# EAGLE design ASBS_radio_v0 (EAGLE 5.11)
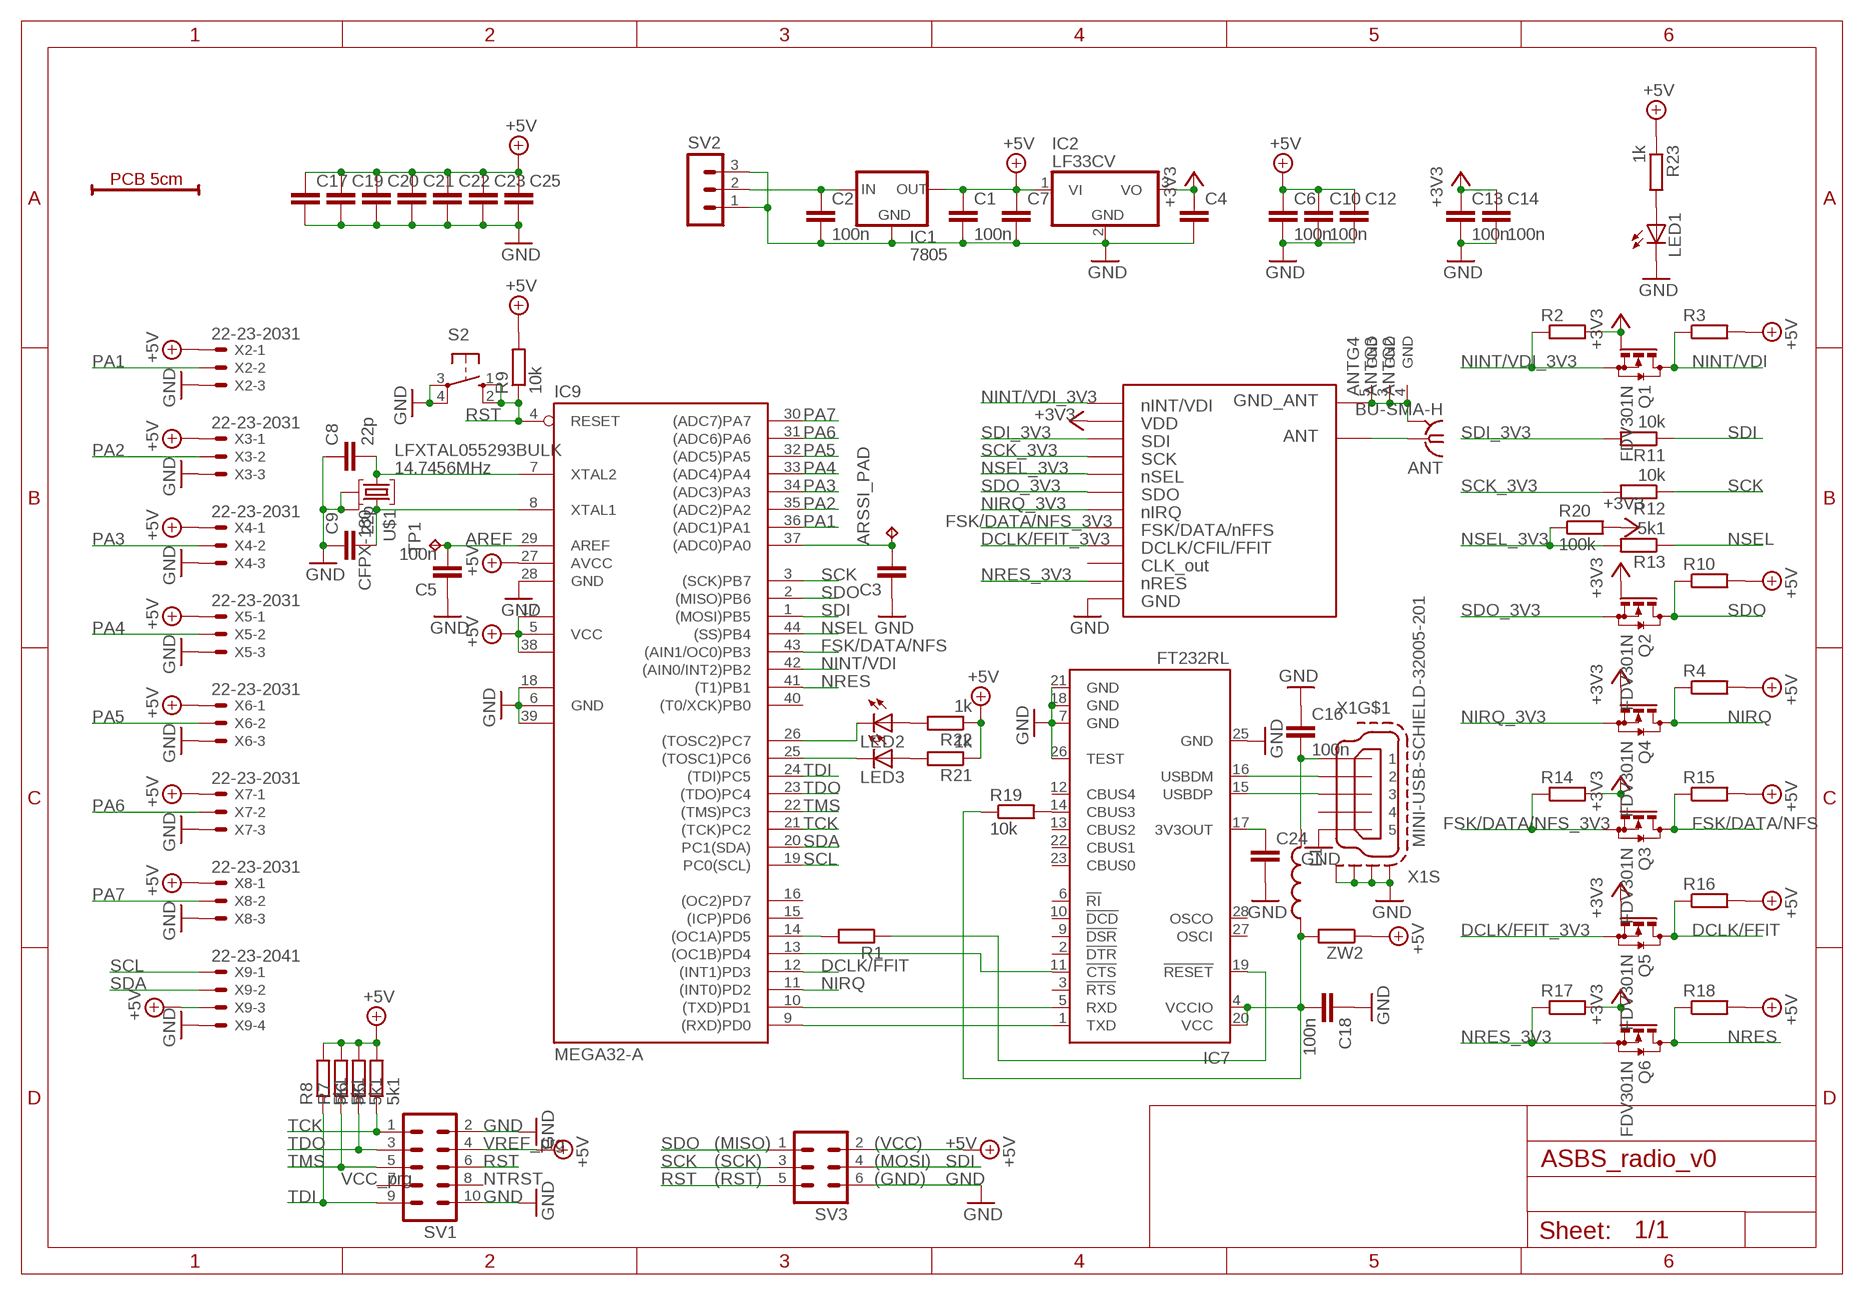
[diagram p0: schematic, sheet 1]

## Parts
ANT  BU-SMA-H  [BU-SMA-H]
ARSSI_PAD  TPTP20R  [TP20R]
C1  100n  C-EUC0805  [C0805]
C2  100n  C-EUC0805  [C0805]
C3  C-EUC0805  [C0805]
C4  C-EUC0805  [C0805]
C5  100n  C-EUC0805  [C0805]
C6  100n  C-EUC0805  [C0805]
C7  C-EUC0805  [C0805]
C8  22p  C-EUC0603K  [C0603K]
C9  22p  C-EUC0603K  [C0603K]
C10  100n  C-EUC0805  [C0805]
C12  C-EUC0805  [C0805]
C13  100n  C-EUC0805  [C0805]
C14  100n  C-EUC0805  [C0805]
C16  100n  C-EUC0805  [C0805]
C17  C-EUC0805  [C0805]
C18  100n  C-EUC0805  [C0805]
C19  C-EUC0805  [C0805]
C20  C-EUC0805  [C0805]
C21  C-EUC0805  [C0805]
C22  C-EUC0805  [C0805]
C23  C-EUC0805  [C0805]
C24  C-EUC0805  [C0805]
C25  C-EUC0805  [C0805]
IC1  7805  78XXS  [78XXS]
IC2  LF33CV  7805TV  [TO220V]
IC7  FT232RL  [SSOP28]
IC9  MEGA32-A  [TQFP44]
L1  L-US0207/5V  [0207/5V]
LED1  LEDCHIP-LED0805  [CHIP-LED0805]
LED2  LEDCHIP-LED0805  [CHIP-LED0805]
LED3  LEDCHIP-LED0805  [CHIP-LED0805]
Q1  FDV301N  BSS123  [SOT23]
Q2  FDV301N  BSS123  [SOT23]
Q3  FDV301N  BSS123  [SOT23]
Q4  FDV301N  BSS123  [SOT23]
Q5  FDV301N  BSS123  [SOT23]
Q6  FDV301N  BSS123  [SOT23]
R1  R-EU_R0603  [R0603]
R2  R-EU_R0603  [R0603]
R3  R-EU_R0603  [R0603]
R4  R-EU_R0603  [R0603]
R5  5k1  R-EU_R0603  [R0603]
R6  5k1  R-EU_R0603  [R0603]
R7  5k1  R-EU_R0603  [R0603]
R8  5k1  R-EU_R0603  [R0603]
R9  10k  R-EU_R0603  [R0603]
R10  R-EU_R0603  [R0603]
R11  10k  R-EU_R0603  [R0603]
R12  10k  R-EU_R0603  [R0603]
R13  5k1  R-EU_R0603  [R0603]
R14  R-EU_R0603  [R0603]
R15  R-EU_M1206  [M1206]
R16  R-EU_R0603  [R0603]
R17  R-EU_R0603  [R0603]
R18  R-EU_R0603  [R0603]
R19  10k  R-EU_R0603  [R0603]
R20  100k  R-EU_M1206  [M1206]
R21  1k  R-EU_R0603  [R0603]
R22  1k  R-EU_R0603  [R0603]
R23  1k  R-EU_R0603  [R0603]
S2  10-XX  [B3F-10XX]
SV1  MA05-2  [MA05-2]
SV2  MA03-1  [MA03-1]
SV3  MA03-2  [MA03-2]
TP1  TPPAD1-17  [P1-17]
U$1  CFPX-180  [CFPX-180]
U$2  RFM12B  [RFM12B_DIL]
U$3  SCALE_5CM  [SCALE_5CM]
X1  MINI-USB-SCHIELD-32005-201  [32005-201]
X2  22-23-2031  [22-23-2031]
X3  22-23-2031  [22-23-2031]
X4  22-23-2031  [22-23-2031]
X5  22-23-2031  [22-23-2031]
X6  22-23-2031  [22-23-2031]
X7  22-23-2031  [22-23-2031]
X8  22-23-2031  [22-23-2031]
X9  22-23-2041  [22-23-2041]
ZW2  R-EU_R0603  [R0603]

## Nets
+3V3: C4.1 C13.1 C14.1 IC2.3(VO) Q1.1(G) Q2.1(G) Q3.1(G) Q4.1(G) Q5.1(G) Q6.1(G) R2.2 R14.2 R17.2 R20.2 U$2.P$2
+5V: C1.1 C6.1 C7.1 C10.1 C12.1 C17.1 C19.1 C20.1 C21.1 C22.1 C23.1 C25.1 IC1.OUT IC2.1(VI) IC9.5(VCC) IC9.17(VCC1) IC9.27(AVCC) IC9.38(VCC2) R3.2 R4.2 R5.2 R6.2 R7.2 R8.2 R9.2 R10.2 R15.2 R16.2 R18.2 R21.1 R22.1 R23.1 SV1.4 SV3.2 X2.1 X3.1 X4.1 X5.1 X6.1 X7.1 X8.1 X9.3 ZW2.1
AREF: C5.2 IC9.29(AREF) TP1.TP
ARSSI: ARSSI_PAD.TP C3.2 IC9.37((ADC0)PA0)
DCLK/FFIT: IC9.12((INT1)PD3) Q5.3(D) R16.1
DCLK/FFIT_3V3: Q5.2(S) U$2.P$9
FSK/DATA/NFS: IC9.43((AIN1/OC0)PB3) Q3.3(D) R15.1
FSK/DATA/NFS_3V3: Q3.2(S) R14.1 U$2.P$8
GND: C1.2 C2.2 C3.1 C4.2 C5.1 C6.2 C7.2 C8.1 C9.1 C10.2 C12.2 C13.2 C14.2 C16.1 C17.2 C18.1 C19.2 C20.2 C21.2 C22.2 C23.2 C24.2 C25.2 IC1.GND IC2.2(GND) IC7.7(GND) IC7.18(GND) IC7.21(GND) IC7.25(GND) IC7.26(TEST) IC9.6(GND) IC9.18(GND1) IC9.28(GND) IC9.39(GND2) LED1.C S2.3(P) S2.4(P1) SV1.2 SV1.10 SV2.1 SV2.3 SV3.6 U$1.P$2 U$1.P$4 U$2.P$12 X1.5 X1.M1(S:S1) X1.M2(S:S2) X1.M3(S:S3) X1.M4(S:S4) X2.3 X3.3 X4.3 X5.3 X6.3 X7.3 X8.3 X9.4
N$1: IC7.11(!CTS) IC9.13((OC1B)PD4)
N$2: IC7.19(!RESET) R1.1
N$3: IC9.14((OC1A)PD5) R1.2
N$4: C2.1 IC1.IN SV2.2
N$5: C9.2 IC9.8(XTAL1) U$1.P$3
N$6: C8.2 IC9.7(XTAL2) U$1.P$1
N$7: IC7.14(CBUS3) R19.2
N$11: ANT.1 U$2.P$13
N$14: IC9.26((TOSC2)PC7) LED2.C
N$15: IC7.1(TXD) IC9.9((RXD)PD0)
N$16: IC7.5(RXD) IC9.10((TXD)PD1)
N$17: IC9.25((TOSC1)PC6) LED3.C
N$18: LED3.A R21.2
N$19: LED2.A R22.2
N$21: LED1.A R23.2
N$39: C18.2 IC7.4(VCCIO) IC7.20(VCC) L1.1 R19.1 ZW2.2
N$43: C16.2 L1.2 X1.1
N$44: IC7.16(USBDM) X1.2
N$45: IC7.15(USBDP) X1.3
N$46: C24.1 IC7.17(3V3OUT)
NINT/VDI: IC9.42((AIN0/INT2)PB2) Q1.3(D) R3.1
NINT/VDI_3V3: Q1.2(S) R2.1 U$2.P$1
NIRQ: IC9.11((INT0)PD2) Q4.3(D) R4.1
NIRQ_3V3: Q4.2(S) U$2.P$7
NRES: IC9.41((T1)PB1) Q6.3(D) R18.1
NRES_3V3: Q6.2(S) R17.1 U$2.P$11
NSEL: IC9.44((SS)PB4) R13.1
NSEL_3V3: R13.2 R20.1 U$2.P$5
PA1: IC9.36((ADC1)PA1) X2.2
PA2: IC9.35((ADC2)PA2) X3.2
PA3: IC9.34((ADC3)PA3) X4.2
PA4: IC9.33((ADC4)PA4) X5.2
PA5: IC9.32((ADC5)PA5) X6.2
PA6: IC9.31((ADC6)PA6) X7.2
PA7: IC9.30((ADC7)PA7) X8.2
RGND: ANT.2(GND) ANT.3(GND) ANT.4(GND) ANT.5(GND) U$2.P$14
RST: IC9.4(RESET) R9.1 S2.1(S) S2.2(S1) SV1.6 SV3.5
SCK: IC9.3((SCK)PB7) R12.1 SV3.3
SCK_3V3: R12.2 U$2.P$4
SCL: IC9.19(PC0(SCL)) X9.1
SDA: IC9.20(PC1(SDA)) X9.2
SDI: IC9.1((MOSI)PB5) R11.1 SV3.4
SDI_3V3: R11.2 U$2.P$3
SDO: IC9.2((MISO)PB6) Q2.3(D) R10.1 SV3.1
SDO_3V3: Q2.2(S) U$2.P$6
TCK: IC9.21((TCK)PC2) R5.1 SV1.1
TDI: IC9.24((TDI)PC5) R8.1 SV1.9
TDO: IC9.23((TDO)PC4) R6.1 SV1.3
TMS: IC9.22((TMS)PC3) R7.1 SV1.5
Unconnected: IC7.2(!DTR) IC7.3(!RTS) IC7.6(!RI) IC7.9(!DSR) IC7.10(!DCD) IC7.12(CBUS4) IC7.13(CBUS2) IC7.22(CBUS1) IC7.23(CBUS0) IC7.27(OSCI) IC7.28(OSCO) IC9.15((ICP)PD6) IC9.16((OC2)PD7) IC9.40((T0/XCK)PB0) SV1.7 SV1.8 U$2.P$10 X1.4

## Notes on the sheet
- LFXTAL055293BULK
- 14.7456MHz
- GND
- VREF_prg | (MISO) | (VCC)
- (SCK) | (MOSI)
- VCC_prg | NTRST | (RST) | (GND)
- GND

## Library data of the parts
ANT = con-coax:BU-SMA-H: FEMALE SMA CONNECTOR Radiall; OC_FARNELL: unknown; OC_NEWARK: unknown
ARSSI_PAD TP1 = testpad:TP: Test pad
C1-C7 C10 C12-C14 C16-C25 = rcl:C-EU: CAPACITOR, European symbol
C8 C9 = resistor:C-EU: CAPACITOR, European symbol
IC1 = v-reg:78XXS: VOLTAGE REGULATOR
IC2 = linear:78*: Positive VOLTAGE REGULATOR Source: http://cache.national.com/ds/LM/LM78L05.pdf http://www.fairchildsemi.com/ds/LM/LM7805.pdf
IC7 = ftdichip:FT232R: Source: http://www.ftdichip.com/Documents/DataSheets/DS_FT232R_v104.pdf; MPN: FT232RL; OC_FARNELL: 1146032; OC_NEWARK: 91K9918
IC9 = atmel:MEGA32: MICROCONTROLLER 32 Kbytes FLASH 2 Kbytes SRAM 1 Kbytes EEPROM USART 8-channel 10 bit ADC Source: www.atmel.com .. doc2503.pdf; MPN: ATMEGA32-16AU; OC_FARNELL: 9171274; OC_NEWARK: 69K6677
L1 = resistor:L-US: INDUCTOR, American symbol
LED1-LED3 = led:LED: LED OSRAM: - CHIPLED LG R971, LG N971, LY N971, LG Q971, LY Q971, LO R971, LY R971 LH N974, LH R974 LS Q976, LO Q976, LY Q976 LO Q996 - Hyper CHIPLED LW Q18S LB Q993, LB Q99A, LB R99A - SideLED LS A670, LO A670, LY A670, LG A670, LP A670 LB A673, LV A673, LT A673, LW A673 LH A674 LY A675 LS A676, LA A676, LO A676, LY A676, LW A676 LS A679, LY A679, LG A679 - Hyper Micro SIDELED® LS Y876, LA Y876, LO Y876, LY Y876 LT Y87S - SmartLED LW L88C, LW L88S LB L89C, LB L89S, LG L890 LS L89K, LO L89K, LY L89K LS L896, LA L896, LO L896, LY L896 - TOPLED LS T670, LO T670, LY T670, LG T670, LP T670 LSG T670, LSP T670, LSY T670, LOP T670, LYG T670 LG T671, LOG T671, LSG T671 LB T673, LV T673, LT T673, LW T673 LH T674 LS T676, LA T676, LO T676, LY T676, LB T676, LH T676, LSB T676, LW T676 LB T67C, LV T67C, LT T67C, LS T67K, LO T67K, LY T67K, LW E67C LS E67B, LA E67B, LO E67B, LY E67B, LB E67C, LV E67C, LT E67C LW T67C LS T679, LY T679, LG T679 LS T770, LO T770, LY T770, LG T770, LP T770 LB T773, LV T773, LT T773, LW T773 LH T774 LS E675, LA E675, LY E675, LS T675 LS T776, LA T776, LO T776, LY T776, LB T776 LHGB T686 LT T68C, LB T68C - Hyper Mini TOPLED® LB M676 - Mini TOPLED Santana® LG M470 LS M47K, LO M47K, LY M47K Source: http://www.osram.convergy.de LUXEON: - LUMILED® LXK2-PW12-R00, LXK2-PW12-S00, LXK2-PW14-U00, LXK2-PW14-V00 LXK2-PM12-R00, LXK2-PM12-S00, LXK2-PM14-U00 LXK2-PE12-Q00, LXK2-PE12-R00, LXK2-PE12-S00, LXK2-PE14-T00, LXK2-PE14-U00 LXK2-PB12-K00, LXK2-PB12-L00, LXK2-PB12-M00, LXK2-PB14-N00, LXK2-PB14-P00, LXK2-PB14-Q00 LXK2-PR12-L00, LXK2-PR12-M00, LXK2-PR14-Q00, LXK2-PR14-R00 LXK2-PD12-Q00, LXK2-PD12-R00, LXK2-PD12-S00 LXK2-PH12-R00, LXK2-PH12-S00 LXK2-PL12-P00, LXK2-PL12-Q00, LXK2-PL12-R00 Source: www.luxeon.com KINGBRIGHT: KA-3528ASYC Source: www.kingbright.com
Q1-Q6 = transistor-small-signal:BSS123: N-CHANNEL MOS FET
R1-R14 R16-R19 R21-R23 ZW2 = resistor:R-EU_: RESISTOR, European symbol
R15 R20 = rcl:R-EU_: RESISTOR, European symbol
S2 = switch-omron:10-XX: OMRON SWITCH; MPN: B3F-1000; OC_FARNELL: 176432; OC_NEWARK: 36M3542
SV1 = con-lstb:MA05-2: PIN HEADER; OC_FARNELL: unknown; OC_NEWARK: unknown
SV2 = con-lstb:MA03-1: PIN HEADER; OC_FARNELL: unknown; OC_NEWARK: unknown
SV3 = con-lstb:MA03-2: PIN HEADER; OC_FARNELL: unknown; OC_NEWARK: unknown
U$1 = crystal_frequency_products:CFPX-180
U$2 = RFM12B:RFM12B
U$3 = scale:SCALE_5CM
X1 = con-cypressindustries:MINI-USB-SCHIELD-: MINI USB-B Conector Source: www.cypressindustries.com; OC_FARNELL: unknown; OC_NEWARK: unknown
X2-X8 = con-molex:22-23-2031: .100" (2.54mm) Center Header - 3 Pin; MF: MOLEX; MPN: 22-23-2031; OC_FARNELL: 1462950; OC_NEWARK: 30C0862
X9 = con-molex:22-23-2041: .100" (2.54mm) Center Header - 4 Pin; MF: MOLEX; MPN: 22-23-2041; OC_FARNELL: 1462920; OC_NEWARK: 38C0355

## Board
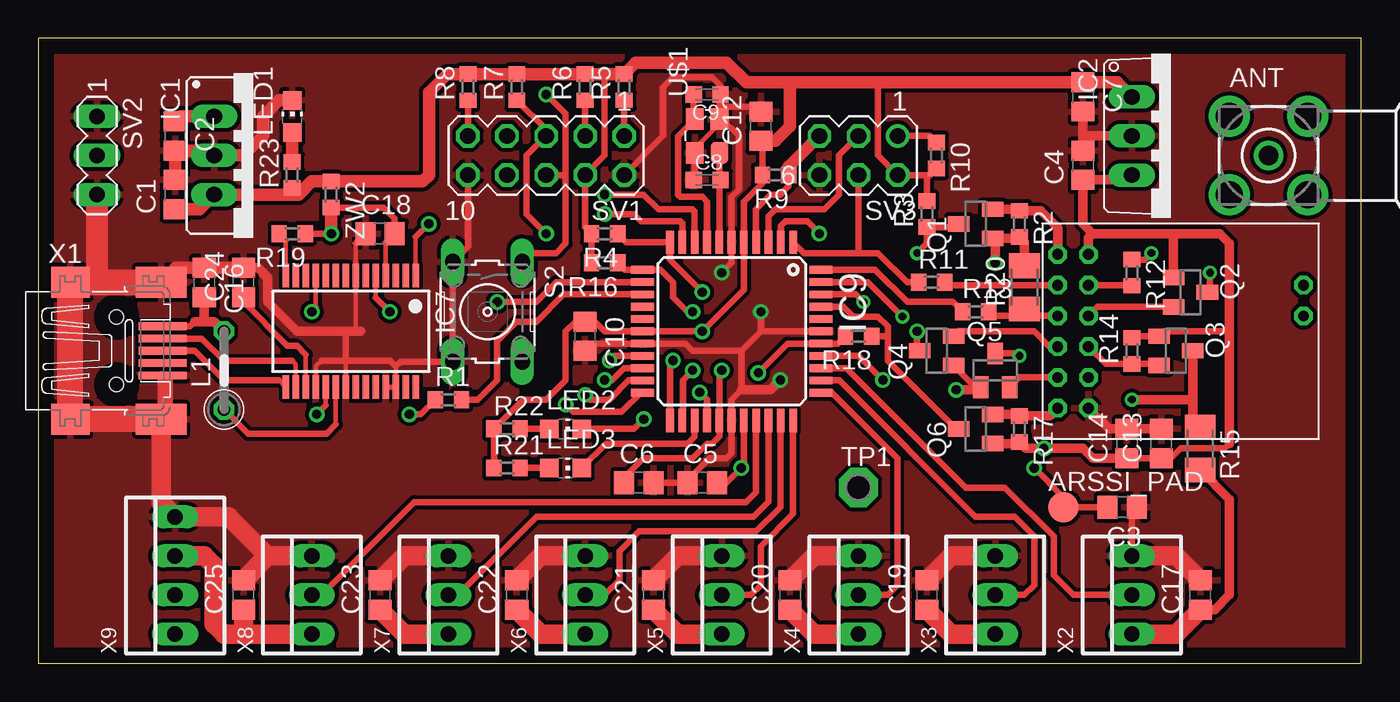
[diagram p1: board, top side]
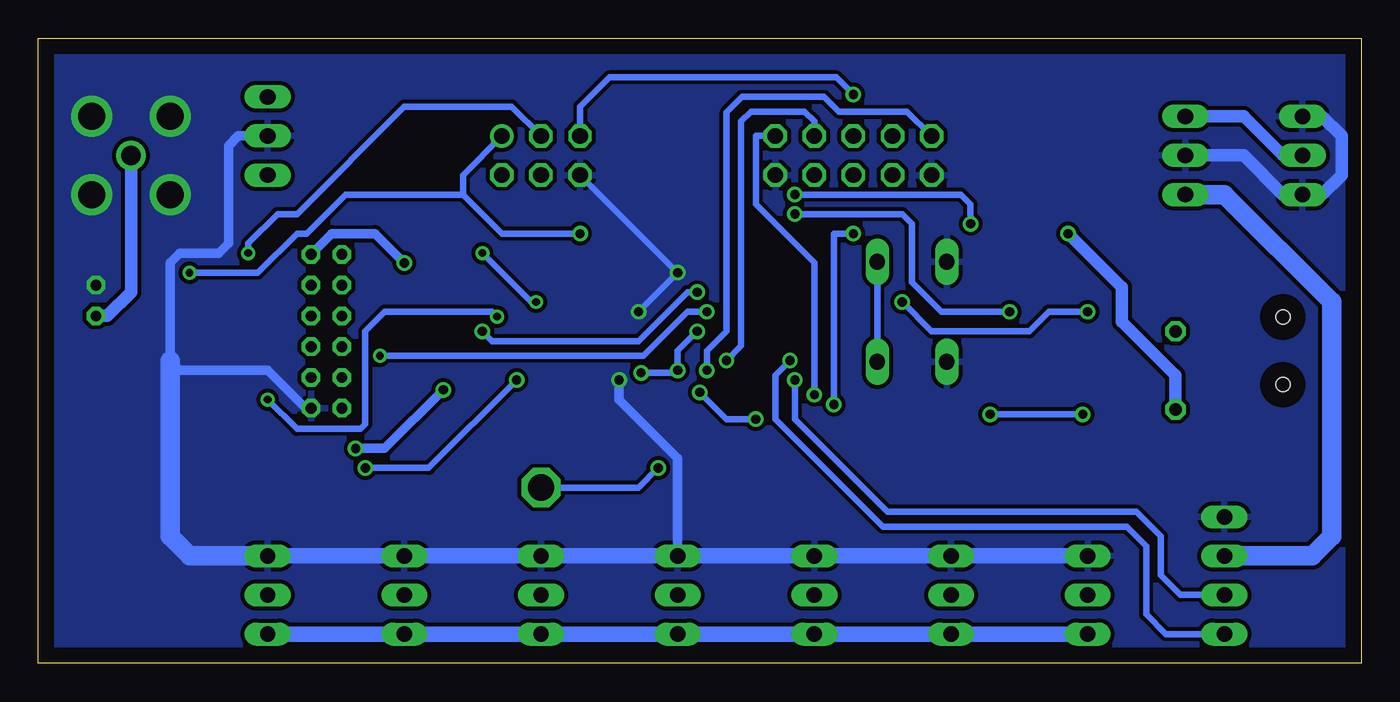
[diagram p2: board, bottom side, seen from below]

Size 86.03 x 40.63 mm. Coordinates in mm from the lower left corner, seen from the top.
Outline: 0,0 86.03,0 86.03,40.63 0,40.63 0,0
Copper layers (1*16): Top 0.035mm / dielectric 1.5mm / Bottom 0.035mm
Design rules "default *": minimum track width 10mil, minimum drill 0.4mm, track to track 10mil, track to pad 10mil, pad to pad 10mil, via to via 10mil, smd to smd 8mil, copper to edge 40mil, drill to drill 8mil, minimum pad ring 10mil, minimum via ring 8mil, stop-mask expansion 4mil, vias tented up to drill 0mil, thermal gap 10mil

### Footprints (pad centres in the part's own frame; a part is rotated, then mirrored left to right if it is on the bottom)
BU-SMA-H = drill 1.27 round: 1 0,0 | drill 1.778 round: 2 -2.55,2.55; 3 2.55,2.55; 4 2.55,-2.55; 5 -2.55,-2.55
TP20R = smd 2 x 2: TP 0,0
C0805 = smd 1.3 x 1.5: 1 -0.95,0; 2 0.95,0
C0603K = smd 1.05 x 1.08: 1 -0.875,0; 2 0.875,0
78XXS = drill 1.016 long: GND 0,-2.54; IN -2.54,-2.54; OUT 2.54,-2.54
TO220V = drill 1.016 long: 1 -2.54,-2.54; 2 0,-2.54; 3 2.54,-2.54
SSOP28 = smd 0.4 x 1.5: 1 -4.225,-3.625; 2 -3.575,-3.625; 3 -2.925,-3.625; 4 -2.275,-3.625; 5 -1.625,-3.625; 6 -0.975,-3.625; 7 -0.325,-3.625; 8 0.325,-3.625; 9 0.975,-3.625; 10 1.625,-3.625; 11 2.275,-3.625; 12 2.925,-3.625; 13 3.575,-3.625; 14 4.225,-3.625; 15 4.225,3.625; 16 3.575,3.625; 17 2.925,3.625; 18 2.275,3.625; 19 1.625,3.625; 20 0.975,3.625; 21 0.325,3.625; 22 -0.325,3.625; 23 -0.975,3.625; 24 -1.625,3.625; 25 -2.275,3.625; 26 -2.925,3.625; 27 -3.575,3.625; 28 -4.225,3.625
TQFP44 = smd 1.5 x 0.5: 1 -5.8,4; 2 -5.8,3.2; 3 -5.8,2.4; 4 -5.8,1.6; 5 -5.8,0.8; 6 -5.8,0; 7 -5.8,-0.8; 8 -5.8,-1.6; 9 -5.8,-2.4; 10 -5.8,-3.2; 11 -5.8,-4; 23 5.8,-4; 24 5.8,-3.2; 25 5.8,-2.4; 26 5.8,-1.6; 27 5.8,-0.8; 28 5.8,0; 29 5.8,0.8; 30 5.8,1.6; 31 5.8,2.4; 32 5.8,3.2; 33 5.8,4 | smd 0.5 x 1.5: 12 -4,-5.8; 13 -3.2,-5.8; 14 -2.4,-5.8; 15 -1.6,-5.8; 16 -0.8,-5.8; 17 0,-5.8; 18 0.8,-5.8; 19 1.6,-5.8; 20 2.4,-5.8; 21 3.2,-5.8; 22 4,-5.8; 34 4,5.8; 35 3.2,5.8; 36 2.4,5.8; 37 1.6,5.8; 38 0.8,5.8; 39 0,5.8; 40 -0.8,5.8; 41 -1.6,5.8; 42 -2.4,5.8; 43 -3.2,5.8; 44 -4,5.8
0207/5V = drill 0.813 octagon: 1 -2.54,0; 2 2.54,0
CHIP-LED0805 = smd 1.2 x 1.2: A 0,-1.05; C 0,1.05
SOT23 = smd 1 x 1.4: 1 -0.95,-1.1; 2 0.95,-1.1; 3 0,1.1
R0603 = smd 1 x 1.1: 1 -0.85,0; 2 0.85,0
M1206 = smd 1.6 x 2: 1 -1.4,0; 2 1.4,0
B3F-10XX = drill 1.016 long: 1 -3.251,2.261; 2 3.251,2.261; 3 -3.251,-2.261; 4 3.251,-2.261
MA05-2 = drill 1.016 octagon: 1 -5.08,-1.27; 2 -5.08,1.27; 3 -2.54,-1.27; 4 -2.54,1.27; 5 0,-1.27; 6 0,1.27; 7 2.54,-1.27; 8 2.54,1.27; 9 5.08,-1.27; 10 5.08,1.27
MA03-1 = drill 1.016 long: 1 -2.54,0; 2 0,0; 3 2.54,0
MA03-2 = drill 1.016 round: 1 -2.54,-1.27 | drill 1.016 octagon: 2 -2.54,1.27; 3 0,-1.27; 4 0,1.27; 5 2.54,-1.27; 6 2.54,1.27
P1-17 = drill 1.702 pad 2.54 octagon: TP 0,0
CFPX-180 = smd 1.4 x 1.15: P$1 -1.1,-0.8; P$2 1.1,-0.8; P$3 1.1,0.8; P$4 -1.1,0.8
RFM12B_DIL = drill 0.7 octagon: P$1 -8,5; P$2 -6,5; P$3 -8,3; P$4 -6,3; P$5 -8,1; P$6 -6,1; P$7 -8,-1; P$8 -6,-1; P$9 -8,-3; P$10 -6,-3; P$11 -8,-5; P$12 -6,-5; P$13 8,1; P$14 8,3
32005-201 = smd 3.1 x 0.5: 1 3,1.6; 2 3,0.8; 3 3,0; 4 3,-0.8; 5 3,-1.6 | smd 2.5 x 2: M1 -3,-4.45; M2 -3,4.45 | smd 3.3 x 2: M3 2.9,4.45; M4 2.9,-4.45 | hole 0.9: 0,2.2; 0,-2.2
22-23-2031 = drill 1 long: 1 -2.54,0; 2 0,0; 3 2.54,0
22-23-2041 = drill 1 long: 1 -3.81,0; 2 -1.27,0; 3 1.27,0; 4 3.81,0

### Placement (x,y rotation side)
ANT  80.01,33.02 0 top
ARSSI_PAD  66.67,10.16 0 top
C1  8.89,30.48 90 top
C2  8.89,34.29 270 top
C3  70.48,10.16 180 top
C4  67.94,32.38 90 top
C5  43.18,11.75 0 top
C6  39.05,11.75 0 top
C7  67.94,36.83 270 top
C8  43.5,31.43 0 top
C9  43.5,36.99 180 top
C10  35.56,21.27 270 top
C12  46.99,34.92 90 top
C13  73.03,14.29 90 top
C14  70.8,14.29 90 top
C16  10.79,24.77 270 top
C17  75.56,4.45 90 top
C18  22.23,27.94 0 top
C19  57.78,4.45 90 top
C20  48.9,4.45 90 top
C21  40.01,4.45 90 top
C22  31.11,4.45 90 top
C23  22.23,4.45 90 top
C24  13.34,24.77 90 top
C25  13.34,4.45 90 top
IC1  13.97,33.02 270 top
IC2  73.66,34.29 270 top
IC7  20.32,21.59 180 top
IC9  45.09,21.59 270 top
L1  12.06,19.05 90 top
LED1  16.51,35.56 0 top
LED2  34.29,15.24 270 top
LED3  34.29,12.7 270 top
Q1  60.96,28.57 90 top
Q2  74.93,24.13 270 top
Q3  73.98,20.32 270 top
Q4  58.42,20.32 90 top
Q5  62.23,19.05 0 top
Q6  60.96,15.24 90 top
R1  26.67,17.14 0 top
R2  63.82,28.57 270 top
R3  57.78,29.21 90 top
R4  36.83,27.94 180 top
R5  38.1,37.47 90 top
R6  35.56,37.47 90 top
R7  31.11,37.47 90 top
R8  27.94,37.47 90 top
R9  47.94,31.75 180 top
R10  58.42,33.02 270 top
R11  58.1,24.77 0 top
R12  71.12,25.4 270 top
R13  60.96,22.86 0 top
R14  71.12,20.32 90 top
R15  75.56,13.97 270 top
R16  36.83,26.04 180 top
R17  63.82,15.24 270 top
R18  53.34,21.27 180 top
R19  16.51,27.94 180 top
R20  64.14,24.45 90 top
R21  30.48,12.7 0 top
R22  30.48,15.24 0 top
R23  16.51,31.75 90 top
S2  29.21,22.86 270 top
SV1  33.02,33.02 180 top
SV2  3.81,33.02 270 top
SV3  53.34,33.02 180 top
TP1  53.34,11.43 0 top
U$1  43.5,34.29 90 top
U$2  74.3,21.59 0 top
U$3  25.4,45.72 180 top  (outside the outline)
X1  5.08,20.32 0 top
X2  71.12,4.45 90 top
X3  62.23,4.45 90 top
X4  53.34,4.45 90 top
X5  44.45,4.45 90 top
X6  35.56,4.45 90 top
X7  26.67,4.45 90 top
X8  17.78,4.45 90 top
X9  8.89,5.71 90 top
ZW2  19.05,30.48 270 top

### Tracks (layer width: path | path; a pad name or v marks a point on that pad's centre or on a via)
+3V3  (via drill 0.6)
  Top 0.406: R14.2 71.22,21.27 Q3.1 73.2,21.59 77.47,21.59 | Q5.1 60.94,17.95 Q4.1 | 77.47,14.29 77.15,13.97 74.3,13.97 73.66,13.34 C13.1 C14.1
  Top 0.61: C14.1 68.58,13.34 67.94,13.97 v65.41,13.97 64.24,13.97 R17.2 63.72,14.29 Q6.1 | Q5.1 61.11,17.78 v59.69,17.78 | 77.47,14.29 77.47,21.59 77.47,27.3 76.83,27.94 73.83,27.94 | U$2.P$2 68.3,27.66 68.58,27.94 | 73.83,27.94 Q2.1 | 73.83,27.94 68.58,27.94 | 68.58,27.94 67.94,28.57 C4.1 70.81,31.43 IC2.3 | R20.2 64.14,27.41 R2.2 63.72,27.62 Q1.1 62.23,27.45 v62.23,26.04
  Bottom 0.61: v59.69,17.78 63.5,13.97 v65.41,13.97 | U$2.P$2 66.94,27.94 64.14,27.94 v62.23,26.04
+5V  (via drill 0.6)
  Top 0.406: R18.2 52.01,20.79 IC9.38 48.73,20.79 v46.83,18.89 | v44.45,19.05 44.28,18.89 IC9.27 44.28,14.76 43.81,14.29 43.5,14.29 42.55,13.34 39.37,13.34 38.1,12.07 C6.1 | R16.2 R4.2 35.56,28.36 SV1.4 36.83,33.02 36.83,38.1 37.05,38.31 R5.2 | R21.1 R22.1 31.54,17.14 33.02,17.14 34.29,18.41 34.29,21.59 34.92,22.22 C10.1 36.2,22.22 36.83,21.59 IC9.17 v43.18,21.59 45.88,24.3 IC9.5 45.88,30.01 47.09,31.22 R9.2 47.09,33.87 C12.1 | 54.61,37.78 54.61,33.02 SV3.2 57.78,31.75 | 57.78,31.75 R3.2 | R10.2 58,31.75 57.78,31.75 | 16.93,30.48 R23.1
  Top 0.61: X2.1 74.3,1.91 | R15.2 77.47,10.66 77.47,4.45 76.52,3.5 C17.1
  Top 0.813: 48.9,37.78 46.04,37.78 44.77,39.05 38.84,39.05 R5.2 R6.2 R7.2 R8.2 26.57,38.31 25.4,37.15 25.4,31.75 24.98,31.33 ZW2.1 17.78,31.33 16.93,30.48 IC1.OUT 10.48,29.53 C1.1 | 48.9,37.78 54.61,37.78 C7.1 70.17,37.78 IC2.1 | 48.9,37.78 48.9,34.92 47.95,33.98 C12.1
  Top 1.27: 13.34,1.91 12.06,1.91 11.43,2.54 11.43,6.35 10.79,6.99 X9.3 | 13.34,1.91 X8.1 | C17.1 73.97,1.91 X2.1 | C19.1 59.38,1.91 X3.1 | C20.1 50.48,1.91 X4.1 | C21.1 41.59,1.91 X5.1 | C22.1 32.7,1.91 X6.1 | C23.1 23.82,1.91 X7.1 | 13.34,1.91 C25.1
  Bottom 0.406: v43.18,21.59 44.45,20.32 v44.45,19.05 44.61,18.89 v46.83,18.89
  Bottom 1.016: X2.1 X3.1 X4.1 X5.1 X6.1 X7.1 X8.1
  Bottom 1.27: IC1.OUT 8.89,30.48 1.91,23.5 1.91,8.26 3.17,6.99 X9.3 9.53,6.99
AREF  (via drill 0.6)
  Top 0.406: IC9.29 45.88,12.87 v45.72,12.7 44.77,11.75 C5.2
  Bottom 0.406: TP1.TP 46.99,11.43 v45.72,12.7
ARSSI  (via drill 0.6)
  Top 0.406: IC9.37 53.35,19.99 v54.93,18.41 | v64.77,12.7 66.67,10.79 ARSSI_PAD.TP C3.2
  Bottom 0.406: v54.93,18.41 60.64,12.7 v64.77,12.7
DCLK/FFIT  (via drill 0.5, 0.6)
  Top 0.406: Q5.3 63.67,20.15 v63.82,20 | v42.55,22.86 42.23,22.86 41.27,23.81 41.27,24.77 40.45,25.59 IC9.12 38.12,25.59 R16.1
  Bottom 0.406: v63.82,20 46.67,20 43.81,22.86 v42.55,22.86
DCLK/FFIT_3V3
  Top 0.406: Q5.2 63.82,18.59 U$2.P$9
FSK/DATA/NFS  (via drill 0.5)
  Top 0.406: IC9.43 53.95,24.79 v56.2,22.54
  Top 0.61: v71.12,17.14 75.08,17.14 | 75.08,17.14 Q3.3 | R15.1 75.08,15.37 75.08,17.14
  Bottom 0.406: v56.2,22.54 56.52,22.86 63.5,22.86 64.77,21.59 64.77,15.56 65.09,15.24 69.22,15.24 v71.12,17.14
FSK/DATA/NFS_3V3
  Top 0.406: U$2.P$8 69.42,19.47 R14.1 72.78,19.47 Q3.2
GND  (via drill 0.6)
  Top 0.305: IC7.18 18.05,19.32 18.41,19.68 | 23.25,19.3 IC7.26 IC7.25 | 20,19.68 IC7.21 | 20.64,21.59 IC7.7 20.64,27.31 | 44.3,35.09 42.7,33.49
  Top 0.406: 8.26,18.41 8.08,18.59 X1.5 | 20,19.68 18.41,19.68 | 20,19.68 22.86,19.68 23.25,19.3 23.55,19.61 S2.4 S2.3 27.94,27.1 SV1.10 | 20.95,21.59 20.64,21.59 20.32,21.59 20,21.59 20,19.68 | v44.45,25.4 45.09,26.04 IC9.6 45.09,30.32 45.56,30.8 45.56,34.29 44.46,35.39 U$1.P$2 | U$1.P$2 44.62,35.39 | U$1.P$2 44.3,36.2 | 44.3,36.2 44.3,36.91 C9.1 44.37,37.54 43.81,38.1 41.27,38.1 40.64,37.47 40.64,34.29 SV1.2 | 42.7,33.49 U$1.P$4 42.7,31.51 C8.1 | U$1.P$2 44.3,35.09 | C12.2 46.67,36.2 44.3,36.2 | 20.64,27.31 C18.1 | C6.2 C5.1 42.23,11.91 43.66,13.34 44.77,13.34 45.09,13.65 IC9.28 45.09,17.14 45.72,17.78 45.72,20.32 | C3.1 71.12,9.85 X2.3 | 45.72,20.32 42.55,20.32 42.08,20.79 IC9.18 36.03,20.79 C10.2 | 45.72,20.32 46.99,21.59 | 46.99,21.59 IC9.39 | 46.99,21.59 v46.99,22.86
  Top 0.61: C24.2 14.29,25.71 14.92,25.08 14.92,23.5 16.83,21.59 20.32,21.59 20.95,21.59 | C13.2 C14.2 69.65,15.24 U$2.P$12 | IC2.2 67.94,34.29 | 67.94,34.29 C7.2 | 67.94,34.29 C4.2 | 45.72,17.78 47.62,17.78 v48.26,18.41
  Top 0.813: X1.M3 8.93,25.71 C16.1 C24.2 | C1.2 C2.2 11.11,33.34 IC1.GND 13.34,33.02 14.61,34.29 14.61,35.56 15.65,36.61 LED1.C
  Top 1.016: X1.M4 8.26,16.14 8.26,18.41
  Top 1.27: X1.M4 7.98,10.44 X9.4 12.38,9.53 14.93,6.99 | C17.2 73.97,6.99 X2.3 | C19.2 59.38,6.99 X3.3 | C20.2 50.48,6.99 X4.3 | C21.2 41.59,6.99 X5.3 | C22.2 32.7,6.99 X6.3 | C23.2 23.82,6.99 X7.3 | 14.93,6.99 C25.2 | 14.93,6.99 X8.3
  Top 1.422: SV2.3 3.81,24.77 X1.M2
  Top 1.676: X1.M3 X1.M2 X1.M1 X1.M4
  Bottom 0.406: v46.99,22.86 v44.45,25.4 SV3.6
  Bottom 0.61: U$2.P$12 68.66,16.59 71.12,19.05 76.83,19.05 77.47,19.68 77.47,26.04 76.83,26.67 74.3,26.67 73.66,27.3 73.66,33.66 73.03,34.29 IC2.2 | v48.26,18.41 48.26,17.14 44.45,13.34 X5.3
  Bottom 0.813: SV2.1 2.54,35.56 1.27,34.29 1.27,31.75 2.54,30.48 SV2.3 5.08,30.48 7.62,33.02 IC1.GND
  Bottom 1.016: X8.3 X7.3 X6.3 X5.3 X4.3 X3.3 X2.3
  Bottom 1.27: X2.3 76.2,6.99 77.47,8.26 77.47,19.68
  pour Top: 0,40.64 0,0 86.36,0 86.36,40.64
  pour Bottom: 0,40.64 0,0 86.36,0 86.36,40.64
N$1  (via drill 0.6)
  Top 0.305: IC7.11 18.05,23.12
  Top 0.406: 18.05,23.12 v17.78,22.86 | IC9.13 33.68,24.79 32.38,23.5 v29.84,23.5
  Bottom 0.406: v17.78,22.86 20.32,22.86 21.59,21.59 27.94,21.59 v29.84,23.5
N$2  (via drill 0.6)
  Top 0.305: 18.7,16.79 IC7.19
  Top 0.406: v18.1,16.19 18.7,16.79 | v24.13,16.19 24.87,16.19 R1.1
  Bottom 0.406: v18.1,16.19 v24.13,16.19
N$3
  Top 0.406: IC9.14 34.15,23.99 32.38,22.23 31.11,22.23 29.84,20.95 29.84,18.41 28.57,17.14 R1.2
N$4
  Top 0.813: C2.1 9.21,35.56 IC1.IN
  Bottom 0.813: SV2.2 5.08,33.02 7.62,35.56 IC1.IN
N$5
  Top 0.406: IC9.8 43.5,27.4 43.5,30 43.18,30.32 41.75,30.32 41.59,30.48 41.59,34.28 U$1.P$3 42.62,35.47 C9.2
N$6
  Top 0.406: U$1.P$1 44.3,31.51 C8.2 44.28,31.34 IC9.7
N$7
  Top 0.305: IC7.14 16.09,27.5
  Top 0.406: 16.09,27.5 R19.2
N$11
  Bottom 0.813: U$2.P$13 81.55,22.59 80.01,24.13 ANT.1
N$14  (via drill 0.6)
  Top 0.406: v43.02,17.62 43.48,17.16 IC9.26 | LED2.C 38.73,15.24 v39.37,15.88
  Bottom 0.406: v39.37,15.88 41.27,15.88 v43.02,17.62
N$15  (via drill 0.6)
  Top 0.305: IC7.1 24.55,27.72
  Top 0.406: v36.83,30.48 39.37,30.48 40.32,29.53 42.55,29.53 42.69,29.39 IC9.9 | 24.55,27.72 v25.4,28.57
  Bottom 0.406: v36.83,30.48 26.04,30.48 25.4,29.84 v25.4,28.57
N$16  (via drill 0.6)
  Top 0.305: IC7.5 21.95,23.77
  Top 0.406: 21.95,23.77 v22.86,22.86 | IC9.10 41.88,28.6 41.75,28.73 39.21,28.73 38.73,29.21 v36.83,29.21
  Bottom 0.406: v22.86,22.86 27.3,22.86 29.21,24.77 29.21,28.57 29.84,29.21 v36.83,29.21
N$17
  Top 0.406: IC9.25 42.69,14.74 42.23,14.29 36.93,14.29 LED3.C
N$18
  Top 0.406: R21.2 LED3.A
N$19
  Top 0.406: R22.2 LED2.A
N$21
  Top 0.813: R23.2 LED1.A
N$39  (via drill 0.6)
  Top 0.305: 19.34,15.54 IC7.20 | 22.59,27.36 IC7.4
  Top 0.406: v19.05,27.94 R19.1 | ZW2.2 22.44,29.63 23.18,28.89 C18.2 22.59,27.36 | L1.1 13.65,14.92 18.73,14.92 19.34,15.54
  Top 0.813: v19.05,27.94 ZW2.2
  Bottom 0.813: L1.1 12.06,18.73 15.56,22.23 15.56,24.45 v19.05,27.94
N$43
  Top 0.406: X1.1 9.86,21.92 10.16,22.23
  Top 0.61: 10.16,22.23 10.79,22.23 | L1.2 11.43,22.23 10.79,22.23 | 10.79,22.23 C16.2
N$44
  Top 0.305: 16.51,19.68 16.75,19.45 IC7.16
  Top 0.406: X1.2 10.63,21.12 12.06,19.68 16.51,19.68
N$45
  Top 0.305: 15.64,18.41 IC7.15
  Top 0.406: 15.64,18.41 12.06,18.41 10.16,20.32 X1.3
N$46
  Top 0.305: IC7.17 17.39,20.07
  Top 0.406: 17.39,20.07 16.83,20.64 16.19,20.64 13.34,23.5 C24.1
NINT/VDI  (via drill 0.5)
  Top 0.406: IC9.42 53.16,23.99 v53.66,23.5 | v57.15,26.67 57.78,27.3 R3.1 59.65,28.36 Q1.3
  Bottom 0.406: v53.66,23.5 53.98,23.5 v57.15,26.67
NINT/VDI_3V3
  Top 0.61: U$2.P$1 66.3,28.32 65.19,29.43 R2.1 63.72,29.52 Q1.2
NIRQ  (via drill 0.6)
  Top 0.406: v43.18,24.13 41.09,26.23 IC9.11 38.23,27.39 R4.1 | v57.15,21.59 57.15,20.49 Q4.3
  Bottom 0.406: v43.18,24.13 43.81,24.13 46.99,20.95 56.52,20.95 v57.15,21.59
NIRQ_3V3
  Top 0.406: U$2.P$7 65.77,20.59 64.77,21.59 59.84,21.59 Q4.2
NRES
  Top 0.406: IC9.41 52.38,23.19 53.02,22.54 54.61,22.54 55.24,21.91 55.24,21.27 | 55.24,21.27 R18.1 | Q6.3 59.69,15.24 55.24,19.68 55.24,21.27
NRES_3V3
  Top 0.61: Q6.2 63.72,16.19 R17.1 65.8,16.09 U$2.P$11
NSEL
  Top 0.406: IC9.44 54.42,25.59 56.52,23.5 59.48,23.5 R13.1
NSEL_3V3
  Top 0.406: 64.59,22.59 62.08,22.59 R13.2 | 64.59,22.59 R20.1 | 64.59,22.59 U$2.P$5
PA1
  Top 0.406: X2.2 67.31,4.45 66.04,5.71 66.04,8.26 62.87,11.43 60.33,11.43 52.56,19.19 IC9.36
PA2
  Top 0.406: X3.2 64.14,4.45 64.77,5.08 64.77,8.26 63.5,9.53 60.96,9.53 52.09,18.39 IC9.35
PA3
  Top 0.406: IC9.34 51.62,17.59 55.88,13.34 55.88,5.08 55.24,4.45 X4.2
PA4
  Top 0.406: X5.2 46.35,4.45 46.99,5.08 46.99,7.62 49.09,9.71 IC9.33
PA5
  Top 0.406: X6.2 36.83,4.45 37.78,5.4 37.78,7.3 39.05,8.57 46.67,8.57 48.26,10.16 48.26,15.77 IC9.32
PA6
  Top 0.406: IC9.31 47.48,10.5 46.51,9.53 32.38,9.53 27.3,4.45 X7.2
PA7
  Top 0.406: IC9.30 46.69,11.12 46.04,10.48 24.45,10.48 18.41,4.45 X8.2
RGND
  pour Bottom (no thermals): 74.93,29.84 74.93,36.83 75.56,37.47 83.82,37.47 84.45,36.83 84.45,21.59 83.82,20.95 80.64,20.95 78.74,22.86 78.74,28.57 78.11,29.21 75.56,29.21
RST  (via drill 0.6)
  Top 0.406: 34.29,31.75 SV1.6 | 34.29,31.75 34.29,35.72 v33.02,36.99 | IC9.4 46.69,29.54 47.62,30.48 48.26,30.48 48.79,31.01 R9.1 | S2.1 32.03,26.67 33.66,26.67 34.29,27.3 34.29,31.75
  Top 0.813: SV3.5 48.79,32.28 R9.1
  Bottom 0.406: S2.2 S2.1 | v33.02,36.99 34.13,38.1 48.9,38.1 50.8,36.2 SV3.5
SCK  (via drill 0.5)
  Top 0.406: R12.1 71.97,26.25 v72.39,26.67 | IC9.3 47.48,29.07 47.94,29.53 51.12,29.53 52.07,30.48 52.07,33.02 SV3.3
  Bottom 0.406: v72.39,26.67 72.39,27.3 70.48,29.21 69.22,29.21 62.23,36.2 55.24,36.2 SV3.3
SCK_3V3
  Top 0.406: R12.2 71.08,24.59 U$2.P$4
SCL  (via drill 0.6)
  Top 0.406: IC9.19 39.27,20 37.47,20 v37.15,19.68
  Bottom 0.406: v37.15,19.68 38.1,18.73 38.1,15.88 31.11,8.89 15.24,8.89 13.97,7.62 13.97,3.17 12.7,1.91 X9.1
SDA  (via drill 0.6)
  Top 0.406: IC9.20 38.08,19.19 37.31,18.41 v36.83,18.41
  Bottom 0.406: v36.83,18.41 36.83,15.88 30.8,9.84 14.61,9.84 13.02,8.26 13.02,5.71 11.75,4.45 X9.2
SDI
  Top 0.406: R11.1 56.52,24.77 54.61,26.67 53.34,26.67 | 53.34,26.67 49.8,26.67 IC9.1 | 53.34,26.67 SV3.4
SDI_3V3
  Top 0.406: U$2.P$3 59.13,24.59 R11.2
SDO  (via drill 0.5, 0.6)
  Top 0.406: Q2.3 76.2,24.3 v76.2,25.4 | R10.1 58,34.29 SV3.1 | IC9.2 48.28,28.44 48.58,28.73 50.01,28.73 v50.8,27.94
  Bottom 0.406: v50.8,27.94 55.88,27.94 58.42,30.48 | v76.2,25.4 71.75,25.4 69.22,27.94 68.58,27.94 66.04,30.48 58.42,30.48 | SV3.1 58.42,31.75 58.42,30.48
SDO_3V3
  Top 0.406: U$2.P$6 68.89,23.18 Q2.2
TCK  (via drill 0.6)
  Top 0.406: SV1.1 R5.1 | IC9.21 38.39,18.39 37.15,17.14 35.88,17.14 v35.56,17.46
  Bottom 0.406: SV1.1 39.37,34.29 39.37,29.84 35.56,26.04 v35.56,17.46
TDI  (via drill 0.6)
  Top 0.406: SV1.9 R8.1 | IC9.24 41.91,15.81 41.91,18.41 v42.55,19.05
  Bottom 0.406: SV1.9 29.53,35.88 33.97,35.88 34.92,36.83 40.27,36.83 41.27,35.82 41.27,21.59 42.55,20.32 v42.55,19.05
TDO  (via drill 0.6)
  Top 0.406: SV1.3 R6.1 | IC9.23 41.09,19.5 v41.27,19.68
  Bottom 0.406: v41.27,19.68 40.32,20.64 40.32,35.24 39.69,35.88 36.2,35.88 35.56,35.24 SV1.3
TMS  (via drill 0.6)
  Top 0.406: v33.02,27.94 31.75,29.21 31.75,33.02 SV1.5 33.02,34.71 R7.1 | IC9.22 39.18,17.59 37.94,16.35 34.77,16.35 v34.29,16.83
  Bottom 0.406: v33.02,27.94 34.29,27.94 v34.29,16.83